# EAGLE design hlw8012_test_board (EAGLE 9.3.2)
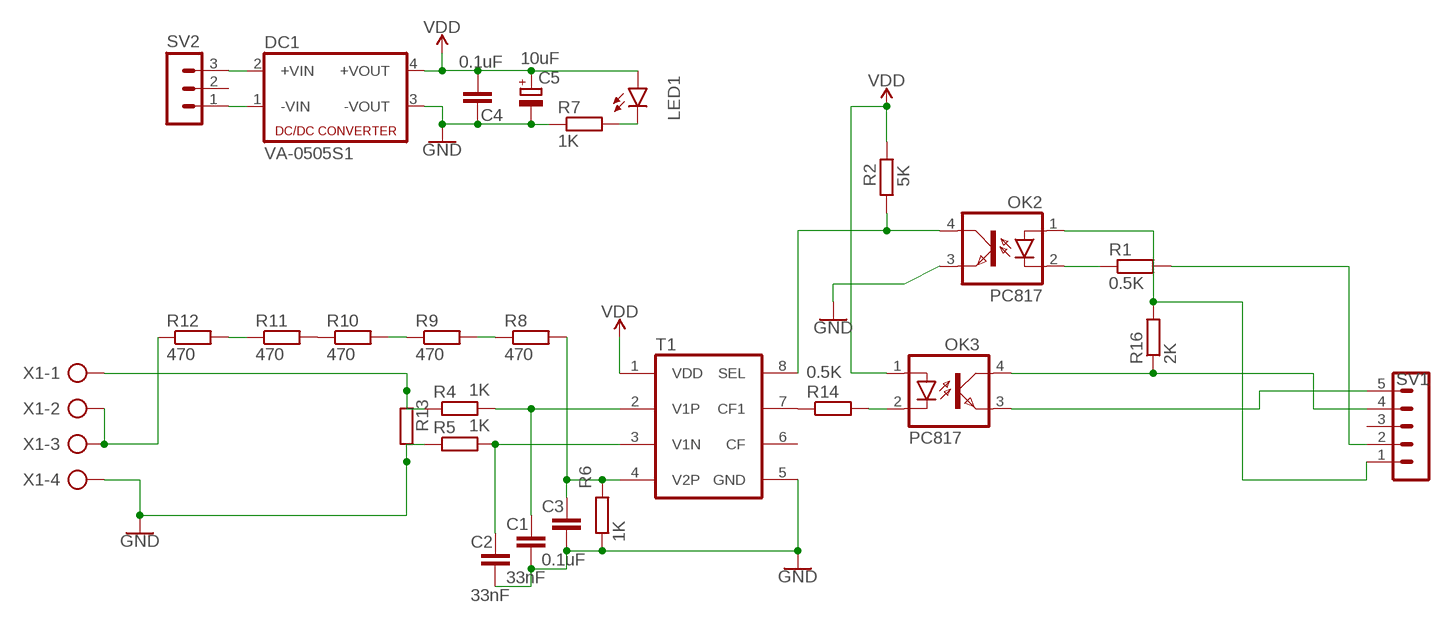
[diagram p0: schematic, sheet 1]

## Parts
C1  33nF  C-EUC0805  [C0805]
C2  33nF  C-EUC0805  [C0805]
C3  0.1uF  C-EUC0805  [C0805]
C4  0.1uF  C-EUC0805  [C0805]
C5  10uF  CPOL-EU153CLV-0405  [153CLV-0405]
DC1  VA-0505S1  [4SIL]
LED1  LED3MM  [LED3MM]
OK2  PC817  [DIL04]
OK3  PC817  [DIL04]
R1  0.5K  R-EU_M0805  [M0805]
R2  5K  R-EU_M0805  [M0805]
R4  1K  R-EU_M0805  [M0805]
R5  1K  R-EU_M0805  [M0805]
R6  1K  R-EU_M0805  [M0805]
R7  1K  R-EU_M0805  [M0805]
R8  470  R-EU_M0805  [M0805]
R9  470  R-EU_M0805  [M0805]
R10  470  R-EU_M0805  [M0805]
R11  470  R-EU_M0805  [M0805]
R12  470  R-EU_M0805  [M0805]
R13  PMD  [PMD]
R14  0.5K  R-EU_M0805  [M0805]
R16  2K  R-EU_M0805  [M0805]
SV1  MA05-1  [MA05-1]
SV2  MA03-1  [MA03-1]
T1  HLW8012  [SO8]
X1  AK300/4  [AK300/4]

## Nets
GND: C1.2 C2.2 C3.2 C4.1 C5.- DC1.3(-VOUT) OK2.3(EMIT) R5.1 R6.1 R7.1 R13.1 T1.5(GND) X1.4
N$1: OK2.1(A) R16.2 SV1.1
N$2: OK2.2(C) R1.1
N$3: R1.2 SV1.2
N$4: OK2.4(COL) R2.1 T1.8(SEL)
N$5: R14.1 T1.7(CF1)
N$6: OK3.4(COL) R16.1 SV1.4
N$7: OK3.2(C) R14.2
N$14: DC1.1(-VIN) SV2.1
N$15: DC1.2(+VIN) SV2.3
N$16: OK3.3(EMIT) SV1.5
N$17: R4.1 R13.2 X1.1
N$18: LED1.K(C) R7.2
N$19: C1.1 R4.2 T1.2(V1P)
N$20: C2.1 R5.2 T1.3(V1N)
N$21: C3.1 R6.2 R8.2 T1.4(V2P)
N$25: R8.1 R9.2
N$26: R9.1 R10.2
N$27: R10.1 R11.2
N$28: R11.1 R12.2
N$30: R12.1 X1.2 X1.3
VDD: C4.2 C5.+ DC1.4(+VOUT) LED1.A OK3.1(A) R2.2 T1.1(VDD)
Unconnected: SV1.3 SV2.2 T1.6(CF)

## Library data of the parts
C1-C4 = rcl:C-EU: CAPACITOR, European symbol; SPICEPREFIX: C
C5 = rcl:CPOL-EU: POLARIZED CAPACITOR, European symbol; SPICEPREFIX: C
DC1 = dc-dc-converter:VA-*?: DC DC Converter Single Output, 1 Watt Motien Technology Co.,Ltd. Source: Data sheet <http://www.motien.com.tw/data_sheet/VA-1%28H%29.pdf>; OC_FARNELL: unknown; OC_NEWARK: unknown
LED1 = led:LED: LED OSRAM: - CHIPLED LG R971, LG N971, LY N971, LG Q971, LY Q971, LO R971, LY R971 LH N974, LH R974 LS Q976, LO Q976, LY Q976 LO Q996 - Hyper CHIPLED LW Q18S LB Q993, LB Q99A, LB R99A - SideLED LS A670, LO A670, LY A670, LG A670, LP A670 LB A673, LV A673, LT A673, LW A673 LH A674 LY A675 LS A676, LA A676, LO A676, LY A676, LW A676 LS A679, LY A679, LG A679 - Hyper Micro SIDELED® LS Y876, LA Y876, LO Y876, LY Y876 LT Y87S - SmartLED LW L88C, LW L88S LB L89C, LB L89S, LG L890 LS L89K, LO L89K, LY L89K LS L896, LA L896, LO L896, LY L896 - TOPLED LS T670, LO T670, LY T670, LG T670, LP T670 LSG T670, LSP T670, LSY T670, LOP T670, LYG T670 LG T671, LOG T671, LSG T671 LB T673, LV T673, LT T673, LW T673 LH T674 LS T676, LA T676, LO T676, LY T676, LB T676, LH T676, LSB T676, LW T676 LB T67C, LV T67C, LT T67C, LS T67K, LO T67K, LY T67K, LW E67C LS E67B, LA E67B, LO E67B, LY E67B, LB E67C, LV E67C, LT E67C LW T67C LS T679, LY T679, LG T679 LS T770, LO T770, LY T770, LG T770, LP T770 LB T773, LV T773, LT T773, LW T773 LH T774 LS E675, LA E675, LY E675, LS T675 LS T776, LA T776, LO T776, LY T776, LB T776 LHGB T686 LT T68C, LB T68C - Hyper Mini TOPLED® LB M676 - Mini TOPLED Santana® LG M470 LS M47K, LO M47K, LY M47K Source: http://www.osram.convergy.de LUXEON: - LUMILED® LXK2-PW12-R00, LXK2-PW12-S00, LXK2-PW14-U00, LXK2-PW14-V00 LXK2-PM12-R00, LXK2-PM12-S00, LXK2-PM14-U00 LXK2-PE12-Q00, LXK2-PE12-R00, LXK2-PE12-S00, LXK2-PE14-T00, LXK2-PE14-U00 LXK2-PB12-K00, LXK2-PB12-L00, LXK2-PB12-M00, LXK2-PB14-N00, LXK2-PB14-P00, LXK2-PB14-Q00 LXK2-PR12-L00, LXK2-PR12-M00, LXK2-PR14-Q00, LXK2-PR14-R00 LXK2-PD12-Q00, LXK2-PD12-R00, LXK2-PD12-S00 LXK2-PH12-R00, LXK2-PH12-S00 LXK2-PL12-P00, LXK2-PL12-Q00, LXK2-PL12-R00 Source: www.luxeon.com KINGBRIGHT: KA-3528ASYC Source: www.kingbright.com
OK2 OK3 = optocoupler:PC817: SHARP OPTO COUPLER; MPN: PC817X4J000F; OC_FARNELL: 9707727; OC_NEWARK: 97K7059
R1 R2 R4-R12 R14 R16 = rcl:R-EU_: RESISTOR, European symbol; SPICEPREFIX: R
R13 = resistor-shunt:PMD: SMD SHUNT RESISTOR; OC_FARNELL: unknown; OC_NEWARK: unknown
SV1 = con-lstb:MA05-1: PIN HEADER; OC_FARNELL: unknown; OC_NEWARK: unknown
SV2 = con-lstb:MA03-1: PIN HEADER; OC_FARNELL: unknown; OC_NEWARK: unknown
T1 = hlw8012:HLW8012: MOS FET
X1 = con-ptr500:AK300/4: CONNECTOR; OC_FARNELL: unknown; OC_NEWARK: unknown

## Board
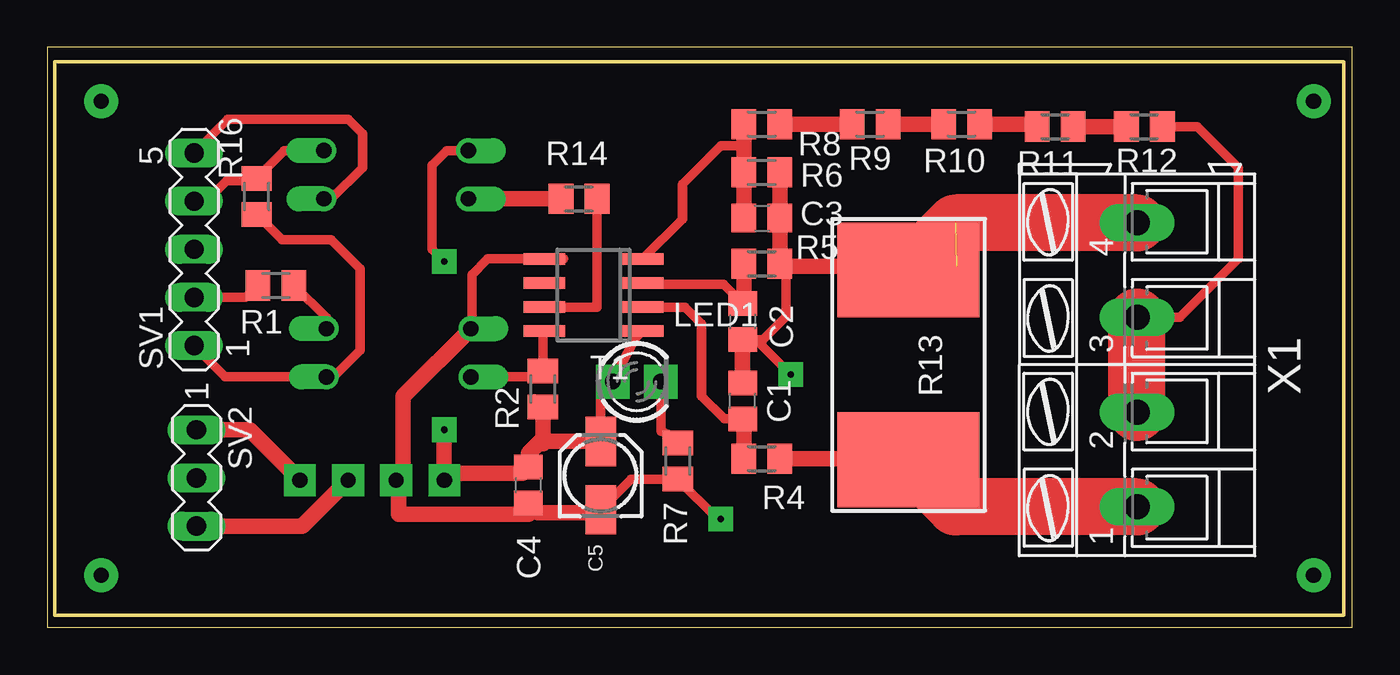
[diagram p1: board, top side]
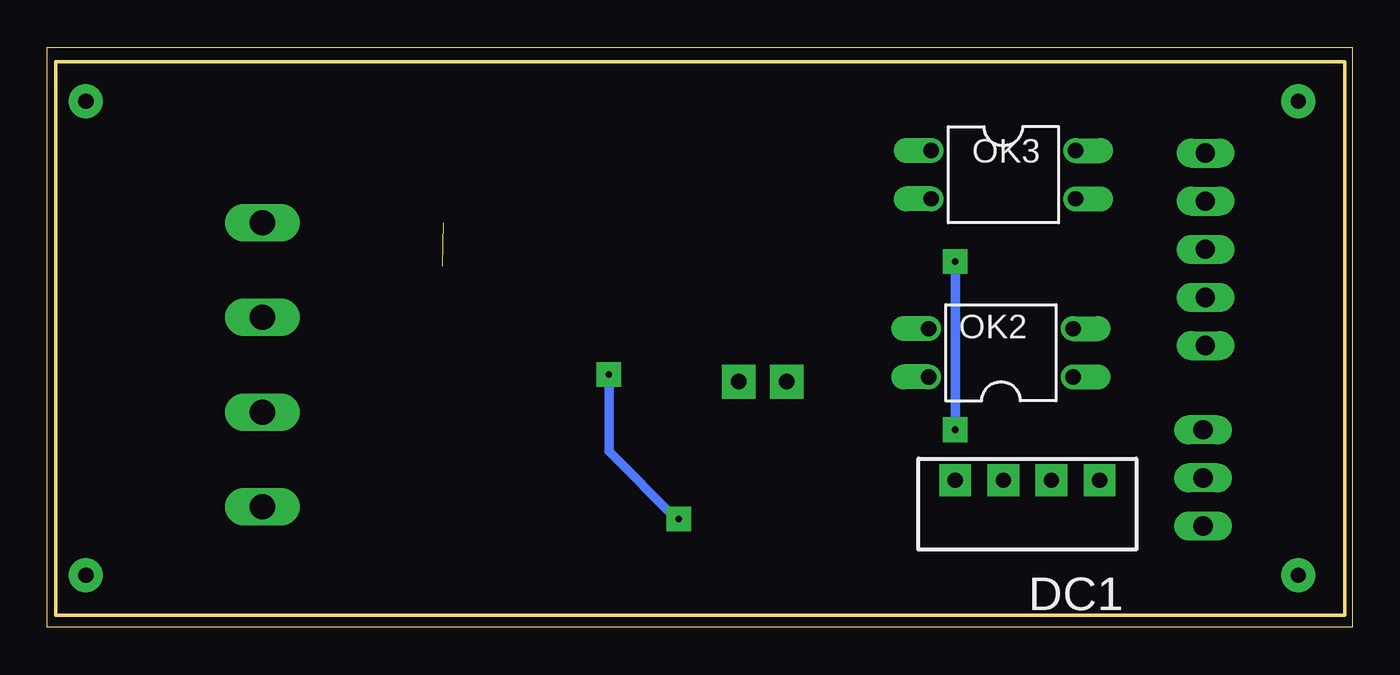
[diagram p2: board, bottom side, seen from below]

Size 68.89 x 30.6 mm. Coordinates in mm from the lower left corner, seen from the top.
Outline: 0,0 68.89,0 68.89,30.6 0,30.6 0,0
Copper layers (1*16): Top 0.035mm / dielectric 1.5mm / Bottom 0.035mm
Design rules "default": minimum track width 6mil, minimum drill 0.35mm, track to track 6mil, track to pad 6mil, pad to pad 6mil, via to via 6mil, smd to smd 6mil, copper to edge 40mil, drill to drill 6mil, minimum pad ring 10mil, minimum via ring 8mil, stop-mask expansion 4mil, vias tented up to drill 0mil, thermal gap 10mil
Milling: 4 lines

### Footprints (pad centres in the part's own frame; a part is rotated, then mirrored left to right if it is on the bottom)
C0805 = smd 1.3 x 1.5: 1 -0.95,0; 2 0.95,0
153CLV-0405 = smd 2.6 x 1.6: + 1.8,0; - -1.8,0
4SIL = drill 0.8 pad 1.676 square: 1 -3.81,0; 2 -1.27,0; 3 1.27,0; 4 3.81,0
LED3MM = drill 0.813 pad 1.778 square: A -1.27,0; K 1.27,0
DIL04 = drill 0.813 offset: 1 -1.27,-3.81; 2 1.27,-3.81; 3 1.27,3.81; 4 -1.27,3.81
M0805 = smd 1.3 x 1.6: 1 -0.95,0; 2 0.95,0
PMD = smd 5 x 7.5: 1 5.258,-0.254; 2 -4.75,-0.254
MA05-1 = drill 1.016 long: 1 -5.08,0; 2 -2.54,0; 3 0,0; 4 2.54,0; 5 5.08,0
MA03-1 = drill 1.016 long: 1 -2.54,0; 2 0,0; 3 2.54,0
SO8 = smd 0.6 x 2.2: 1 -1.905,-2.6; 2 -0.635,-2.6; 3 0.635,-2.6; 4 1.905,-2.6; 5 1.905,2.6; 6 0.635,2.6; 7 -0.635,2.6; 8 -1.905,2.6
AK300/4 = drill 1.321 long: 1 -7.493,0; 2 -2.515,0; 3 2.515,0; 4 7.493,0

### Placement (x,y rotation side)
C1  36.7,11.94 90 top
C2  36.7,16.13 270 top
C3  37.72,21.59 0 top
C4  25.4,7.49 90 top
C5  29.21,8 90 top
DC1  17.14,7.75 180 bottom
LED1  31.12,12.95 0 top
OK2  18.54,14.48 90 bottom
OK3  18.41,23.88 270 bottom
R1  12.07,18.03 180 top
R2  26.16,12.57 270 top
R4  37.72,8.89 180 top
R5  37.72,19.18 180 top
R6  37.72,24 180 top
R7  33.27,8.76 90 top
R8  37.72,26.54 180 top
R9  43.43,26.54 180 top
R10  48.26,26.54 180 top
R11  53.21,26.42 180 top
R12  57.91,26.42 180 top
R13  45.21,13.59 90 top
R14  28.07,22.61 180 top
R16  11.05,22.73 270 top
SV1  7.75,19.94 90 top
SV2  7.87,7.87 270 top
T1  28.83,17.53 90 top
X1  57.53,13.84 90 top

### Tracks (layer width: path | path; a pad name or v marks a point on that pad's centre or on a via)
GND  (via drill 0.35 pad 1.3)  (1 unrouted)
  Top 0.508: 29.19,5.15 C5.- 30.82,7.81 R7.1 35.37,5.71 v35.56,5.71 | 27.24,19.43 T1.5 | 38.86,18.98 R5.1 38.99,18.86 38.99,16.38 37.78,15.18 C2.2 37.4,15.18 v39.24,13.34 | 25.65,19.43 T1.5 | T1.5 23.24,19.43 22.42,18.61 22.42,15.81 OK2.3
  Top 0.813: 48.01,19.05 38.8,19.05 R5.1 C3.2 R6.1 | C1.2 C2.2 | C5.- 29.04,6.04 25.91,6.04 C4.1 25.4,5.97 18.54,5.97 18.54,7.62 DC1.3 18.78,8.11 18.78,12.17 22.42,15.81
  Top 3: X1.4 47.95,21.34 R13.1
  Bottom 0.508: v39.24,13.34 39.24,9.27 35.69,5.71 v35.56,5.71
N$1
  Top 0.508: SV1.1 9.4,13.21 OK2.1 15.11,13.21 16.51,14.61 16.51,18.92 14.99,20.45 12.39,20.45 R16.2
N$2
  Top 0.508: R1.1 14.73,16.32 OK2.2
N$3
  Top 0.508: R1.2 10.48,17.4 SV1.2
N$4
  Top 0.508: 25.84,13.84 R2.1 | R2.1 | R2.1 26.16,15.55 T1.8 | OK2.4 25.85,13.21 R2.1
N$5
  Top 0.508: T1.7 29.02,16.89 R14.1
N$6
  Top 0.508: OK3.4 12.51,25.15 R16.1 10.92,23.56 9.46,23.56 8.38,22.48 SV1.4
N$7
  Top 0.813: R14.2 OK3.2
N$14
  Top 0.813: DC1.1 10.67,10.41 SV2.1
N$15
  Top 0.813: DC1.2 13.46,5.33 SV2.3
N$16
  Top 0.508: OK3.3 14.99,22.61 16.64,24.26 16.64,26.03 15.88,26.8 9.52,26.8 SV1.5
N$17
  Top 0.813: R4.1 45.41,8.89 R13.2
  Top 3: X1.1 47.95,6.35 R13.2
N$18
  Top 0.508: LED1.K 32.38,10.35 33.27,10 R7.2
N$19
  Top 0.508: C1.1 35.75,10.99 34.54,12.19 34.54,16 33.65,16.89 T1.2
  Top 0.813: R4.2 36.77,10.92 C1.1
N$20
  Top 0.508: 32.2,18.16 T1.3 31.5,18.09 35.69,18.09 C2.1
  Top 0.813: C2.1 36.77,17.15 R5.2
N$21
  Top 0.508: T1.4 33.53,21.53 33.53,23.37 35.56,25.4 36.77,25.4
  Top 0.813: R8.2 36.77,25.4 R6.2 C3.1
N$22  (via drill 0.8 pad 1.8)
  other vias: 66.85,2.75
N$25
  Top 0.813: R8.1 R9.2
N$26
  Top 0.813: R9.1 R10.2
N$27
  Top 0.813: R10.1 52.14,26.54 R11.2
N$28
  Top 0.813: R11.1 R12.2
N$30
  Top 0.508: X1.2 56.36,11.33 | X1.3 59.79,16.36 62.86,19.43 62.86,24.26 60.71,26.42 R12.1
  Top 3: X1.2 X1.3
N$31  (via drill 0.8 pad 1.8)
  other vias: 66.85,27.75
N$32  (via drill 0.8 pad 1.8)
  other vias: 2.85,2.75
N$33  (via drill 0.8 pad 1.8)
  other vias: 2.85,27.75
VDD  (via drill 0.35 pad 1.3)
  Top 0.508: T1.1 30.99,15.18 LED1.A 29.21,12.32 C5.+ | R2.2 25.72,12.06 | v20.96,19.3 20.32,19.94 20.32,24.38 21.08,25.15 OK3.1
  Top 0.813: 26.04,9.8 26.16,9.67 R2.2 | 26.04,9.8 25.4,9.17 C4.2 25.09,8.13 21.34,8.13 DC1.4 v20.96,10.41 | C5.+ 26.04,9.8
  Bottom 0.508: v20.96,10.41 v20.96,19.3